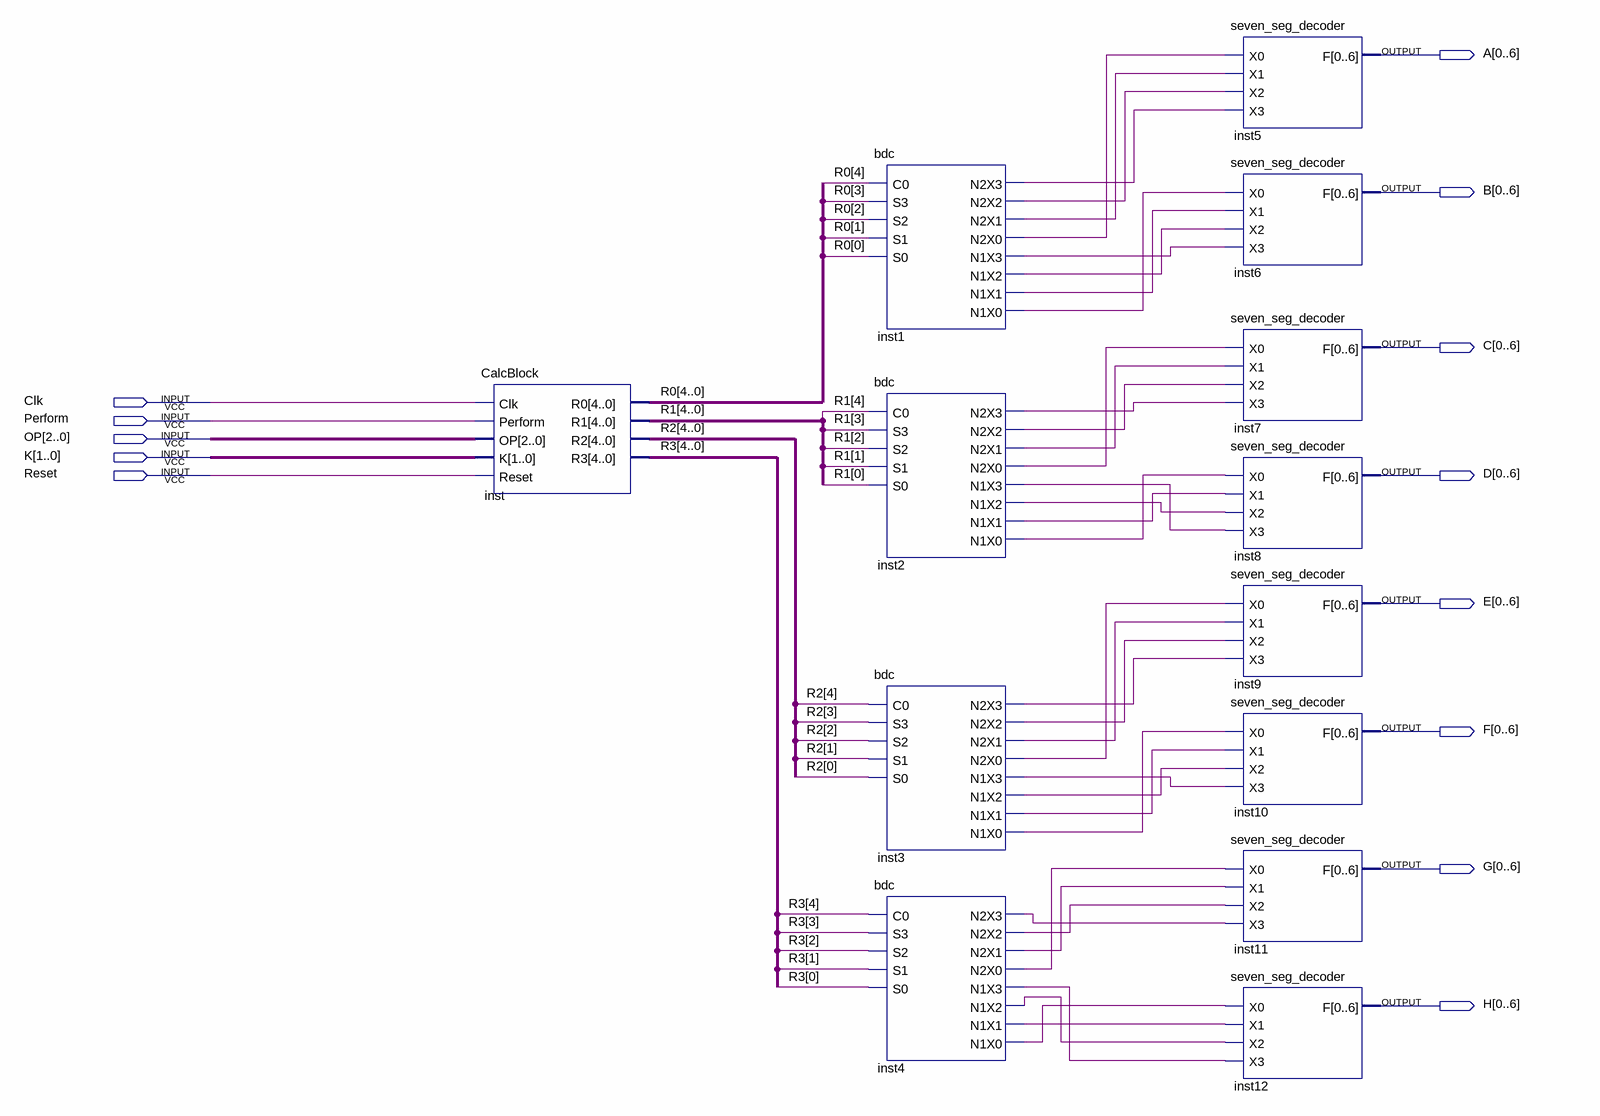
[diagram p0: schematic sheet]
// Quartus schematic DigitalCalculator.bdf as structural Verilog: 13 symbols, 13 pins
module DigitalCalculator (
  input  Clk,
  input  Perform,
  input  [2:0] OP,
  input  [1:0] K,
  input  Reset,
  output [0:6] A,
  output [0:6] B,
  output [0:6] C,
  output [0:6] D,
  output [0:6] E,
  output [0:6] F,
  output [0:6] G,
  output [0:6] H
);

  wire inst1_n1x0, inst1_n1x1, inst1_n1x2, inst1_n1x3, inst1_n2x0, inst1_n2x1, inst1_n2x2, inst1_n2x3,
       inst2_n1x0, inst2_n1x1, inst2_n1x2, inst2_n1x3, inst2_n2x0, inst2_n2x1, inst2_n2x2, inst2_n2x3,
       inst3_n1x0, inst3_n1x1, inst3_n1x2, inst3_n1x3, inst3_n2x0, inst3_n2x1, inst3_n2x2, inst3_n2x3,
       inst4_n1x0, inst4_n1x1, inst4_n1x2, inst4_n1x3, inst4_n2x0, inst4_n2x1, inst4_n2x2, inst4_n2x3;
  wire [4:0] R0, R1, R2, R3;

  CalcBlock inst (.Clk(Clk), .Perform(Perform), .OP(OP), .K(K), .Reset(Reset), .R0(R0), .R1(R1), .R2(R2), .R3(R3));
  bdc inst1 (
    .C0(R0[4]), .S3(R0[3]), .S2(R0[2]), .S1(R0[1]), .S0(R0[0]), .N2X3(inst1_n2x3), .N2X2(inst1_n2x2),
    .N2X1(inst1_n2x1), .N2X0(inst1_n2x0), .N1X3(inst1_n1x3), .N1X2(inst1_n1x2), .N1X1(inst1_n1x1),
    .N1X0(inst1_n1x0));
  bdc inst2 (
    .C0(R1[4]), .S3(R1[3]), .S2(R1[2]), .S1(R1[1]), .S0(R1[0]), .N2X3(inst2_n2x3), .N2X2(inst2_n2x2),
    .N2X1(inst2_n2x1), .N2X0(inst2_n2x0), .N1X3(inst2_n1x3), .N1X2(inst2_n1x2), .N1X1(inst2_n1x1),
    .N1X0(inst2_n1x0));
  bdc inst3 (
    .C0(R2[4]), .S3(R2[3]), .S2(R2[2]), .S1(R2[1]), .S0(R2[0]), .N2X3(inst3_n2x3), .N2X2(inst3_n2x2),
    .N2X1(inst3_n2x1), .N2X0(inst3_n2x0), .N1X3(inst3_n1x3), .N1X2(inst3_n1x2), .N1X1(inst3_n1x1),
    .N1X0(inst3_n1x0));
  bdc inst4 (
    .C0(R3[4]), .S3(R3[3]), .S2(R3[2]), .S1(R3[1]), .S0(R3[0]), .N2X3(inst4_n2x3), .N2X2(inst4_n2x2),
    .N2X1(inst4_n2x1), .N2X0(inst4_n2x0), .N1X3(inst4_n1x3), .N1X2(inst4_n1x2), .N1X1(inst4_n1x1),
    .N1X0(inst4_n1x0));
  seven_seg_decoder inst5 (.X0(inst1_n2x0), .X1(inst1_n2x1), .X2(inst1_n2x2), .X3(inst1_n2x3), .F(A));
  seven_seg_decoder inst6 (.X0(inst1_n1x0), .X1(inst1_n1x1), .X2(inst1_n1x2), .X3(inst1_n1x3), .F(B));
  seven_seg_decoder inst7 (.X0(inst2_n2x0), .X1(inst2_n2x1), .X2(inst2_n2x2), .X3(inst2_n2x3), .F(C));
  seven_seg_decoder inst8 (.X0(inst2_n1x0), .X1(inst2_n1x1), .X2(inst2_n1x2), .X3(inst2_n1x3), .F(D));
  seven_seg_decoder inst9 (.X0(inst3_n2x0), .X1(inst3_n2x1), .X2(inst3_n2x2), .X3(inst3_n2x3), .F(E));
  seven_seg_decoder inst10 (.X0(inst3_n1x0), .X1(inst3_n1x1), .X2(inst3_n1x2), .X3(inst3_n1x3), .F(F));
  seven_seg_decoder inst11 (.X0(inst4_n2x0), .X1(inst4_n2x1), .X2(inst4_n2x2), .X3(inst4_n2x3), .F(G));
  seven_seg_decoder inst12 (.X0(inst4_n1x0), .X1(inst4_n1x1), .X2(inst4_n1x2), .X3(inst4_n1x3), .F(H));
endmodule
